# EasyEDA schematic schematic-EasyEDA.json
TITLE: Receiver; REV: 1.0; Date: 2020-06-02; Sheet: 1/1; Drawn By: Alex Stefanov
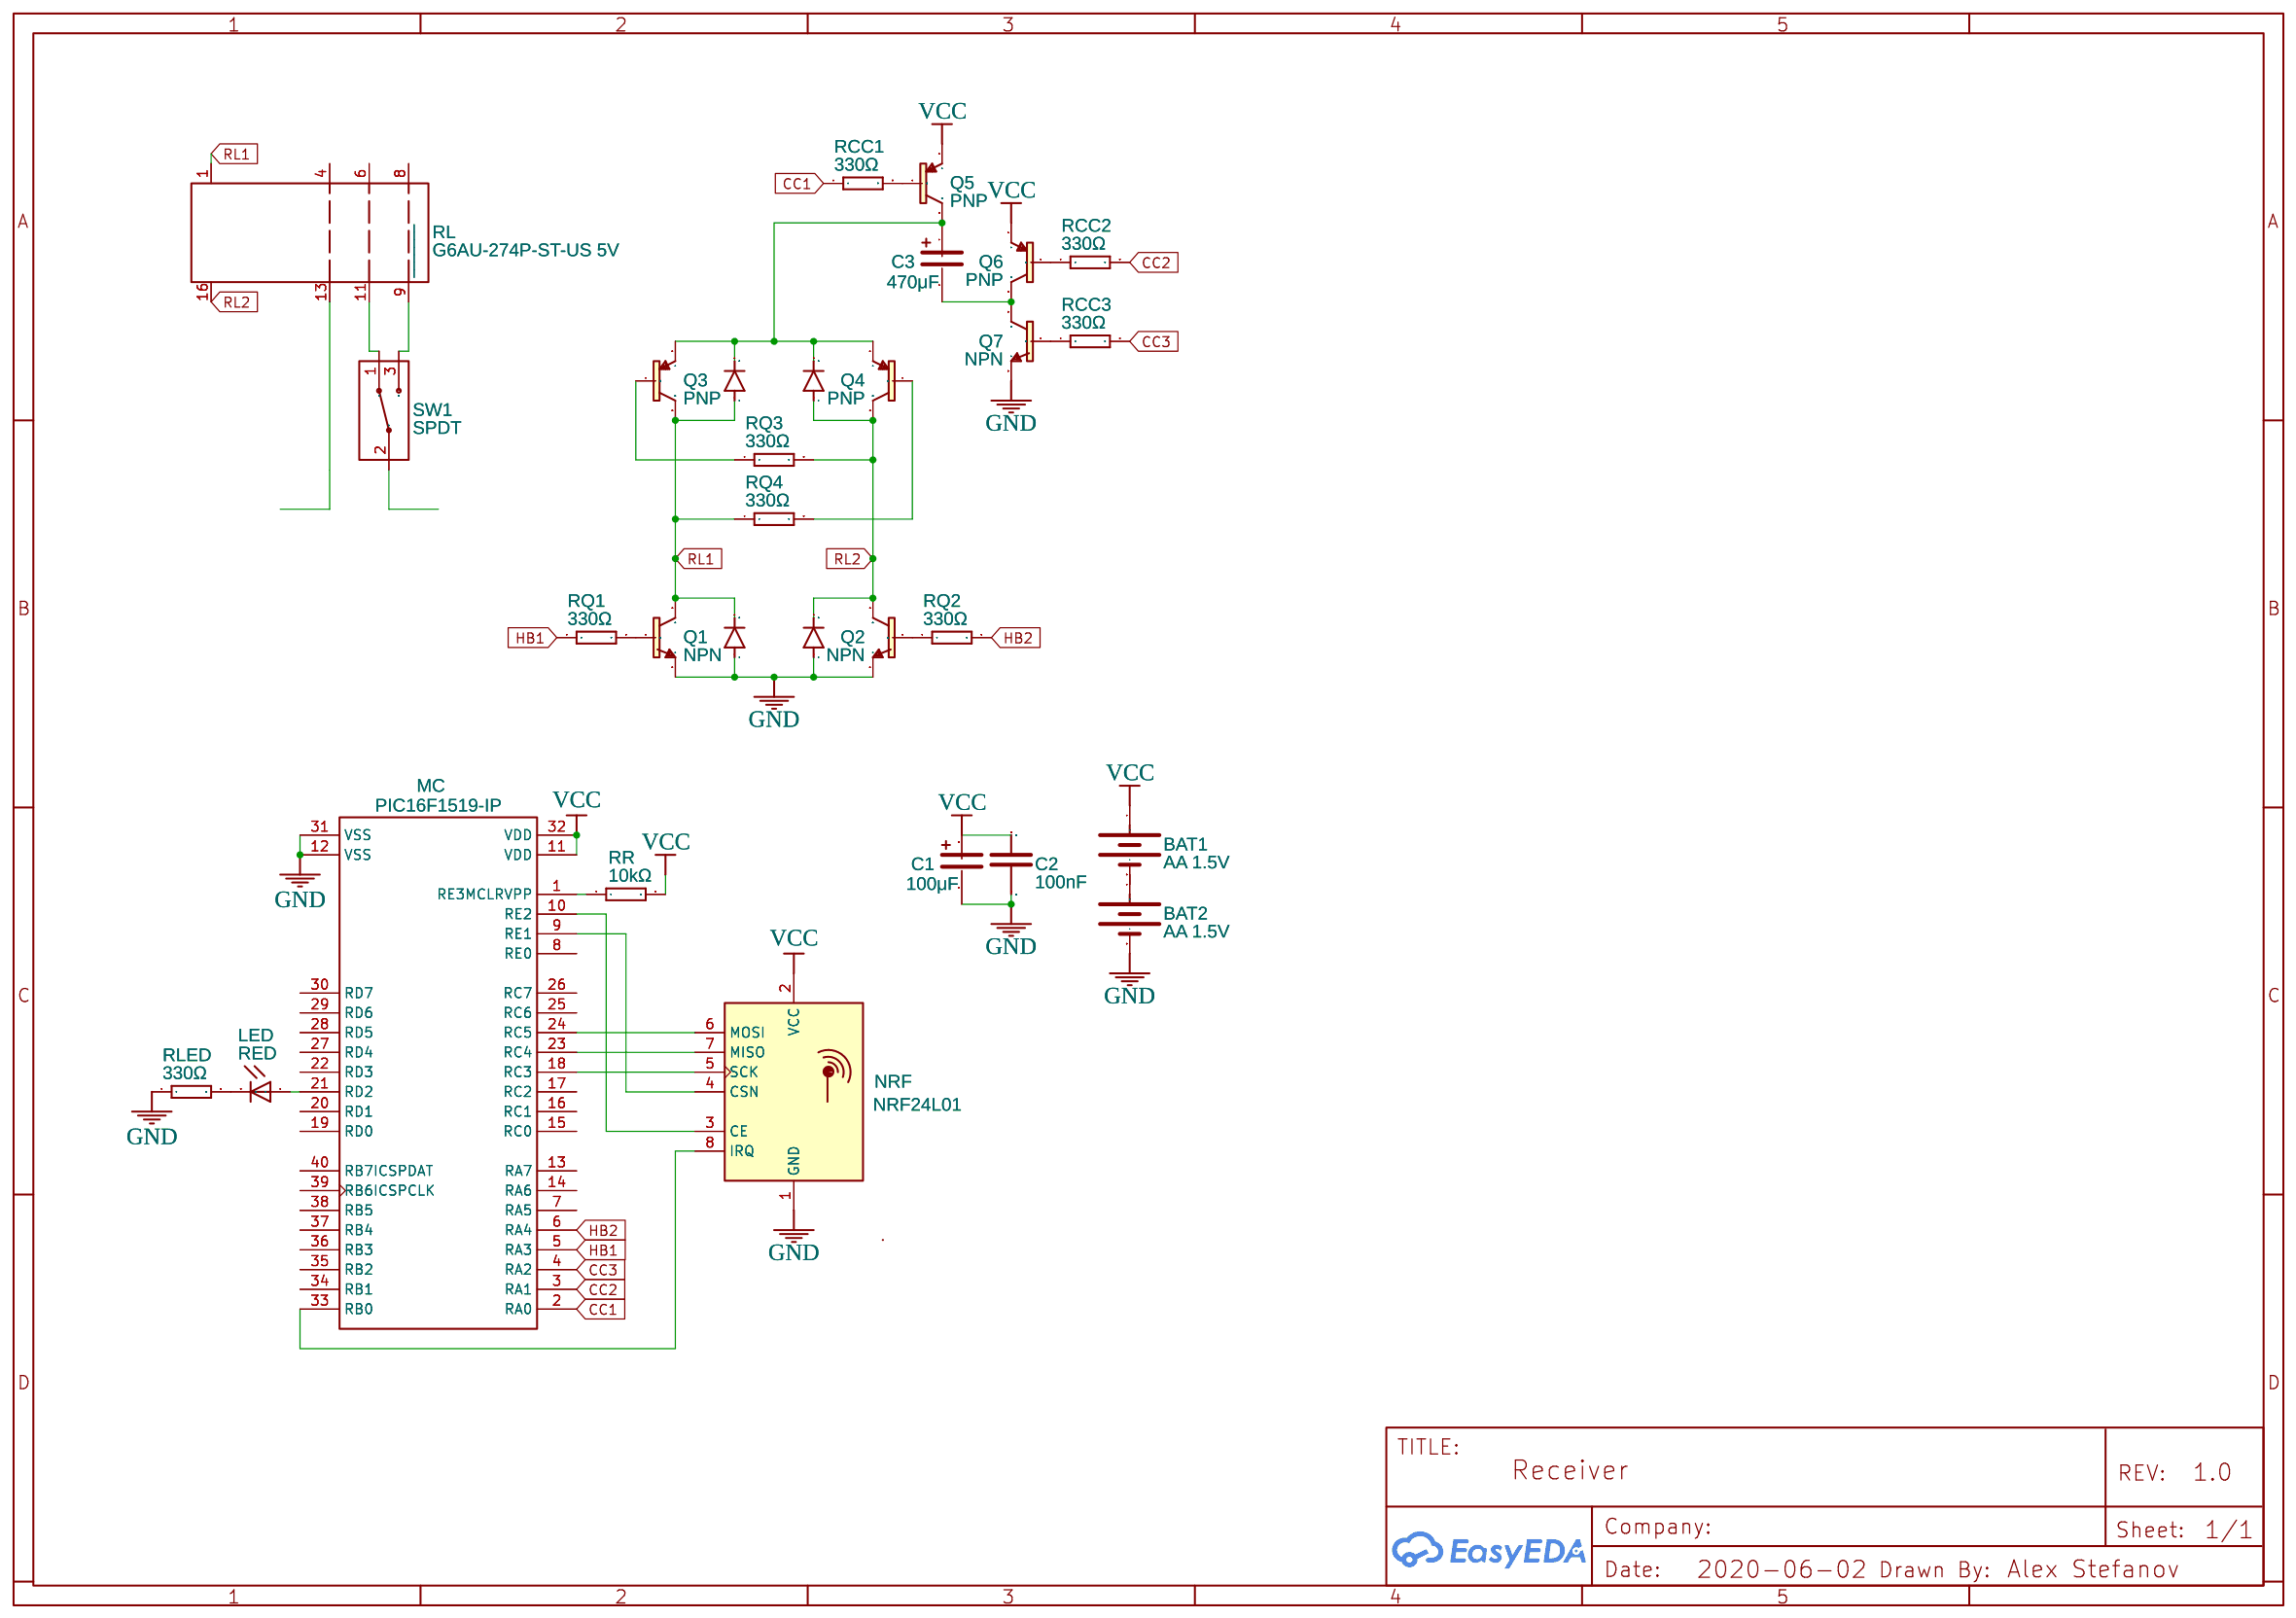
[diagram p0: schematic sheet]

## Parts
BAT1  AA 1.5V  [BATTCON_245MM]
BAT2  AA 1.5V  [BATTCON_245MM]
C1  100μF  [&#126;]
C2  100nF  [TWO_IO]
C3  470μF  [&#126;]
G  DIODE  [SOD-323]
G1  DIODE  [SOD-323]
G2  DIODE  [SOD-323]
G3  DIODE  [SOD-323]
LED  RED  [OSRAM-SIDELED]
MC  PIC16F1519-IP  [DIP40]
NRF  NRF24L01  [NRF24L01_BREAKOUT]
Q1  NPN  [SOT23]
Q2  NPN  [SOT23]
Q3  PNP  [SOT23-3]
Q4  PNP  [SOT23-3]
Q5  PNP  [SOT23-3]
Q6  PNP  [SOT23-3]
Q7  NPN  [SOT23]
RCC1  330Ω  [R402]
RCC2  330Ω  [R402]
RCC3  330Ω  [R402]
RL  G6AU-274P-ST-US 5V  [RS PRO SPDT PCB MOUNT NON-LATCHING RELAY, 5V COIL, 20 A MINIATURE POWER RELAY]
RLED  330Ω  [R402]
RQ1  330Ω  [R402]
RQ2  330Ω  [R402]
RQ3  330Ω  [R402]
RQ4  330Ω  [R402]
RR  10kΩ  [R402]
SW1  SPDT

## Library data of the parts
BAT1 BAT2 = BATTERY: Contributor: SparkFun
C1 C3 = Capacitor-Polarized_EN60617-4_04-02-05_Date20121108: Contributor: KiCAD; license: https://www.gnu.org/licenses/lgpl-2.1.html
C2 = CAPACITOR
G G1-G3 = DIODE: Contributor: Szarpik
LED = LED: Contributor: Adafruit
MC = PIC16F1519-IP: Flash Microcontroller with XLP Technology, 20 MHz, 35 IO, -40 to 85 degC, 40-pin PDIP (P40), Tube
NRF = NRF24L01_Breakout: Contributor: KiCAD; license: https://www.gnu.org/licenses/lgpl-2.1.html
Q1 Q2 Q7 = TRANSISTOR_NPN: Contributor: SparkFun
Q3-Q6 = TRANSISTOR_PNP: Contributor: SparkFun
RCC1-RCC3 RLED RQ1-RQ4 RR = RESISTOR: Contributor: DangerousPrototype
RL = RS Pro SPDT PCB Mount Non-Latching Relay, 5V Coil, 20 A Miniature Power Relay: Supplier Part: 800-4495; Supplier: RS-Online; link: http://uk.rs-online.com/web/p/non-latching-relays/8004495/; Contributor: M1CJE
SW1 = SPDT: Contributor: rienvillage

## Nets
GND: BAT2.2(-) C1.2 C2.P$2 G.A G1.A MC.12(VSS) MC.31(VSS) NRF.1(GND) Q1.2(E) Q2.2(E) Q7.2(E) RLED.1
VCC: BAT1.1(+) C2.P$1 MC.11(VDD) MC.32(VDD) NRF.2(VCC) Q5.2(E) Q6.2(E) RR.2
CC1: MC.2(RA0) RCC1.1
CC2: MC.3(RA1) RCC2.2
CC3: MC.4(RA2) RCC3.2
HB1: MC.5(RA3) RQ1.1
HB2: MC.6(RA4) RQ2.2
RL1: G.C G2.A Q1.3(C) Q3.3(C) RL.1 RQ4.1
RL2: G1.C G3.A Q2.3(C) Q4.3(C) RL.16 RQ3.2
Net-(BAT1-2): BAT1.2(-) BAT2.1(+)
Net-(C3-1): C3.1 G2.C G3.C Q3.2(E) Q4.2(E) Q5.3(C)
Net-(C3-2): C3.2 Q6.3(C) Q7.3(C)
Net-(LED-A): LED.A MC.21(RD2)
Net-(LED-C): LED.C RLED.2
Net-(MC-1): MC.1(RE3MCLRVPP) RR.1
Net-(MC-9): MC.9(RE1) NRF.4(CSN)
Net-(MC-10): MC.10(RE2) NRF.3(CE)
Net-(MC-18): MC.18(RC3) NRF.5(SCK)
Net-(MC-23): MC.23(RC4) NRF.7(MISO)
Net-(MC-24): MC.24(RC5) NRF.6(MOSI)
Net-(MC-33): MC.33(RB0) NRF.8(IRQ)
Net-(Q1-1): Q1.1(B) RQ1.2
Net-(Q2-1): Q2.1(B) RQ2.1
Net-(Q3-1): Q3.1(B) RQ3.1
Net-(Q4-1): Q4.1(B) RQ4.2
Net-(Q5-1): Q5.1(B) RCC1.2
Net-(Q6-1): Q6.1(B) RCC2.1
Net-(Q7-1): Q7.1(B) RCC3.1
Net-(RL-9): RL.9(       ) SW1.3
Net-(RL-11): RL.11 SW1.1

Not connected (* = marked no-connect by the designer): C1 1; MC 7(RA5) 8(RE0) 13(RA7) 14(RA6) 15(RC0) 16(RC1) 17(RC2) 19(RD0) 20(RD1) 22(RD3) 25(RC6) 26(RC7) 27(RD4) 28(RD5) 29(RD6) 30(RD7) 34(RB1) 35(RB2) 36(RB3) 37(RB4) 38(RB5) 39(RB6ICSPCLK) 40(RB7ICSPDAT); RL 4 6 8 13; SW1 2
